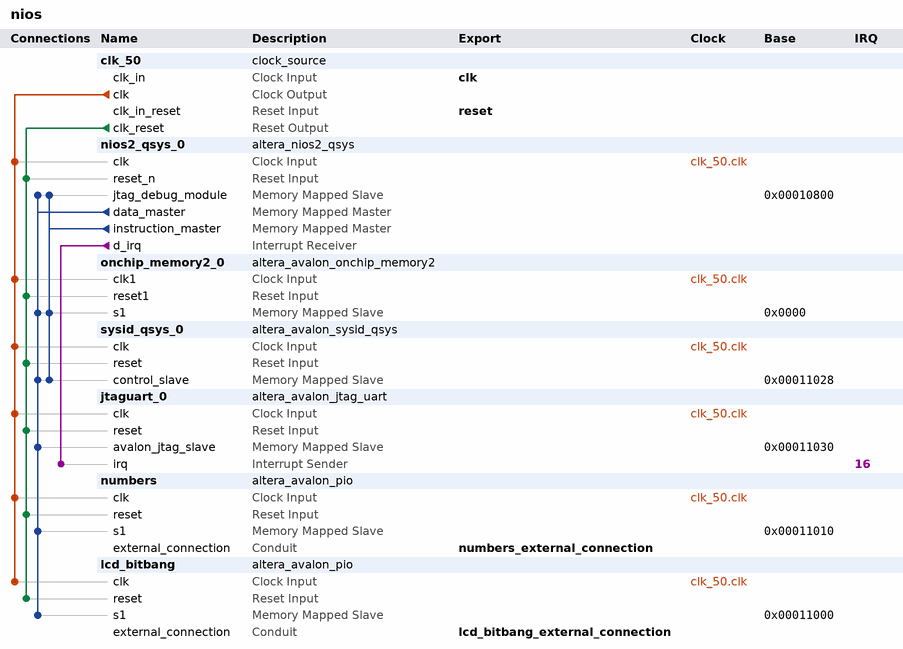
[diagram p0: system contents]
# Platform Designer (Qsys) system nios, Cyclone IV E EP4CE115F29C7
# Parameters at their usual value, and those the tool derives, are not listed.
package require -exact qsys 15.0
create_system nios
set_project_property DEVICE_FAMILY {Cyclone IV E}
set_project_property DEVICE EP4CE115F29C7

add_instance clk_50 clock_source 15.0
set_instance_parameter_value clk_50 clockFrequency 50000000

add_instance nios2_qsys_0 altera_nios2_qsys 15.0
set_instance_parameter_value nios2_qsys_0 breakSlave nios2_qsys_0.jtag_debug_module
set_instance_parameter_value nios2_qsys_0 exceptionSlave onchip_memory2_0.s1
set_instance_parameter_value nios2_qsys_0 icache_size 4096
set_instance_parameter_value nios2_qsys_0 impl Tiny
set_instance_parameter_value nios2_qsys_0 mmu_TLBMissExcSlave None
set_instance_parameter_value nios2_qsys_0 resetSlave onchip_memory2_0.s1
set_instance_parameter_value nios2_qsys_0 resetrequest_enabled true

add_instance onchip_memory2_0 altera_avalon_onchip_memory2 15.0
set_instance_parameter_value onchip_memory2_0 dataWidth 32
set_instance_parameter_value onchip_memory2_0 dualPort false
set_instance_parameter_value onchip_memory2_0 initMemContent true
set_instance_parameter_value onchip_memory2_0 initializationFileName onchip_mem.hex
set_instance_parameter_value onchip_memory2_0 memorySize 40960

add_instance sysid_qsys_0 altera_avalon_sysid_qsys 15.0
set_instance_parameter_value sysid_qsys_0 id 0

add_instance jtaguart_0 altera_avalon_jtag_uart 15.0
set_instance_parameter_value jtaguart_0 simInteractiveOptions NO_INTERACTIVE_WINDOWS

add_instance numbers altera_avalon_pio 15.0
set_instance_parameter_value numbers direction Input
set_instance_parameter_value numbers width 16

add_instance lcd_bitbang altera_avalon_pio 15.0
set_instance_parameter_value lcd_bitbang direction Output
set_instance_parameter_value lcd_bitbang width 11

# connections
add_connection clk_50.clk jtaguart_0.clk clock
add_connection clk_50.clk lcd_bitbang.clk clock
add_connection clk_50.clk nios2_qsys_0.clk clock
add_connection clk_50.clk numbers.clk clock
add_connection clk_50.clk onchip_memory2_0.clk1 clock
add_connection clk_50.clk sysid_qsys_0.clk clock
add_connection clk_50.clk_reset jtaguart_0.reset reset
add_connection clk_50.clk_reset lcd_bitbang.reset reset
add_connection clk_50.clk_reset nios2_qsys_0.reset_n reset
add_connection clk_50.clk_reset numbers.reset reset
add_connection clk_50.clk_reset onchip_memory2_0.reset1 reset
add_connection clk_50.clk_reset sysid_qsys_0.reset reset
add_connection nios2_qsys_0.data_master jtaguart_0.avalon_jtag_slave avalon
set_connection_parameter_value nios2_qsys_0.data_master/jtaguart_0.avalon_jtag_slave baseAddress 0x00011030
add_connection nios2_qsys_0.data_master lcd_bitbang.s1 avalon
set_connection_parameter_value nios2_qsys_0.data_master/lcd_bitbang.s1 baseAddress 0x00011000
add_connection nios2_qsys_0.data_master nios2_qsys_0.jtag_debug_module avalon
set_connection_parameter_value nios2_qsys_0.data_master/nios2_qsys_0.jtag_debug_module baseAddress 0x00010800
add_connection nios2_qsys_0.data_master numbers.s1 avalon
set_connection_parameter_value nios2_qsys_0.data_master/numbers.s1 baseAddress 0x00011010
add_connection nios2_qsys_0.data_master onchip_memory2_0.s1 avalon
set_connection_parameter_value nios2_qsys_0.data_master/onchip_memory2_0.s1 baseAddress 0x0000
add_connection nios2_qsys_0.data_master sysid_qsys_0.control_slave avalon
set_connection_parameter_value nios2_qsys_0.data_master/sysid_qsys_0.control_slave baseAddress 0x00011028
add_connection nios2_qsys_0.instruction_master nios2_qsys_0.jtag_debug_module avalon
set_connection_parameter_value nios2_qsys_0.instruction_master/nios2_qsys_0.jtag_debug_module baseAddress 0x00010800
add_connection nios2_qsys_0.instruction_master onchip_memory2_0.s1 avalon
set_connection_parameter_value nios2_qsys_0.instruction_master/onchip_memory2_0.s1 baseAddress 0x0000
add_connection nios2_qsys_0.instruction_master sysid_qsys_0.control_slave avalon
set_connection_parameter_value nios2_qsys_0.instruction_master/sysid_qsys_0.control_slave baseAddress 0x00011028
add_connection nios2_qsys_0.d_irq jtaguart_0.irq interrupt
set_connection_parameter_value nios2_qsys_0.d_irq/jtaguart_0.irq irqNumber 16

# exported interfaces
add_interface clk clock sink
set_interface_property clk EXPORT_OF clk_50.clk_in
add_interface lcd_bitbang_external_connection conduit end
set_interface_property lcd_bitbang_external_connection EXPORT_OF lcd_bitbang.external_connection
add_interface numbers_external_connection conduit end
set_interface_property numbers_external_connection EXPORT_OF numbers.external_connection
add_interface reset reset sink
set_interface_property reset EXPORT_OF clk_50.clk_in_reset

set_interconnect_requirement {$system} qsys_mm.clockCrossingAdapter HANDSHAKE
set_interconnect_requirement {$system} qsys_mm.enableEccProtection FALSE
set_interconnect_requirement {$system} qsys_mm.insertDefaultSlave FALSE
set_interconnect_requirement {$system} qsys_mm.maxAdditionalLatency 1

save_system nios.qsys
